# Altium project TMP100NA_Breakout.PrjPcb
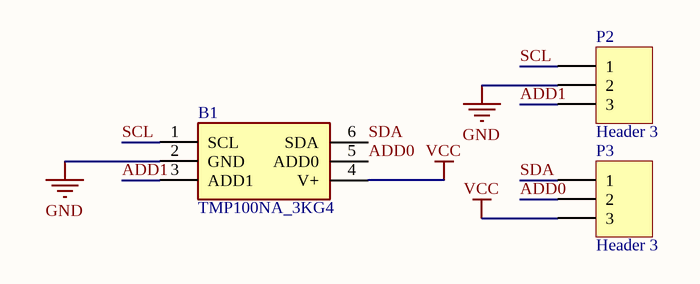
[diagram p0: board1.SchDoc]
1 sheet, 3 parts. Net scope: global (net labels, ports and power ports of the same name join across sheets).
Board file: board1.PcbDoc

## Sheet board1.SchDoc
size A4; SheetNumber: 1; SheetTotal: 1

### Parts
B1  TMP100NA_3KG4  [SOT95P280X145-6N]
P2  Header 3  [HDR1X3]
P3  Header 3  [HDR1X3]

### Nets
GND: B1.2(GND) P2.2
VCC: B1.4(V+) P3.3
ADD0: B1.5(ADD0) P3.2
ADD1: B1.3(ADD1) P2.3
SCL: B1.1(SCL) P2.1
SDA: B1.6(SDA) P3.1

### Library data of the parts
B1 = TMP100NA_3KG4: Board Mount Temperature Sensors Digital Temp Sensor w/I2C Ser Interface; Manufacturer_Name: Texas Instruments; Manufacturer_Part_Number: TMP100NA/3KG4; Geometry.Height: 1.45mm; Mouser Part Number: 595-TMP100NA/3KG4; Mouser Price/Stock: https://www.mouser.co.uk/ProductDetail/Texas-Instruments/TMP100NA-3KG4?qs=RnzODY3cU8vFEcRbQgecuQ%3D%3D; Datasheet Link: https://www.ti.com/lit/ds/symlink/tmp100.pdf?HQS=dis-mous-null-mousermode-dsf-pf-null-wwe&ts=1645782280887&ref_url=https%253A%252F%252Fwww.mouser.in%252F
P2 P3 = Header 3: Header, 3-Pin; LatestRevisionDate: 17-Jul-2002; LatestRevisionNote: Re-released for DXP Platform.; Publisher: Altium Limited